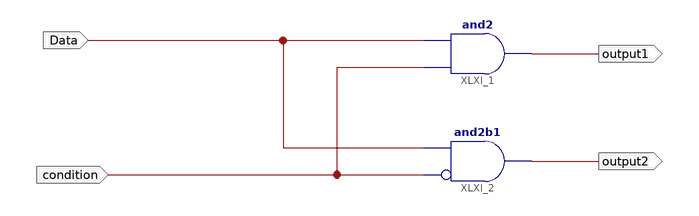
[diagram p0: schematic sheet 1]
// Xilinx ISE schematic ConditionalBlock.sch (spartan3a) as structural Verilog: 2 symbols, 4 ports
module ConditionalBlock (
  input  condition,
  input  Data,
  output output2,
  output output1
);

  and XLXI_2 (output2, ~condition, Data);  // and2b1
  and XLXI_1 (output1, condition, Data);
endmodule
